# Altium schematic sheet Sensors.SchDoc
size A; SheetNumber: 3; SheetTotal: 6
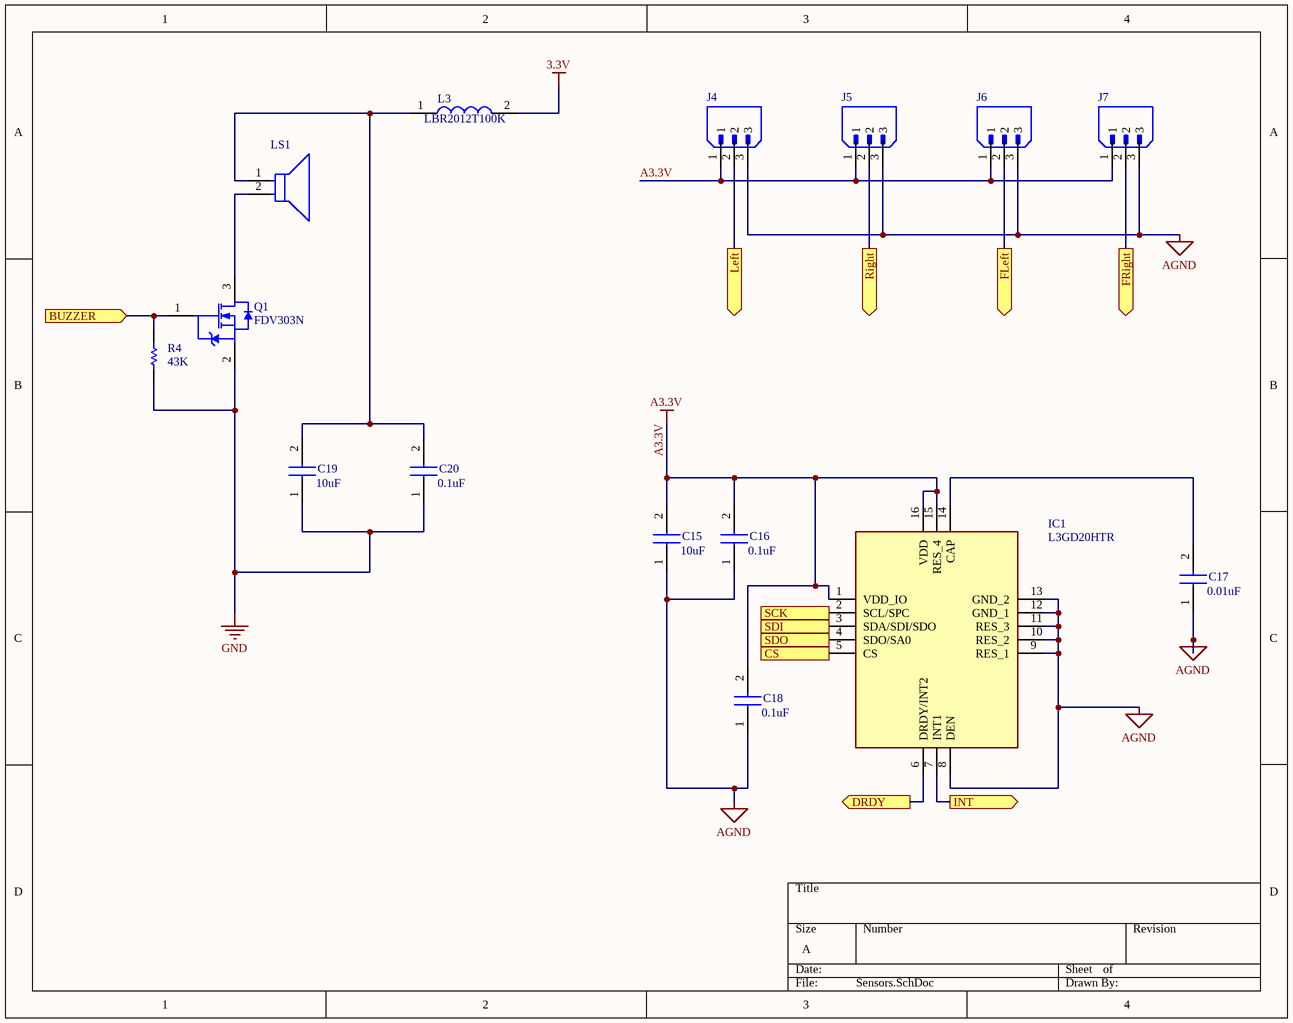
[diagram p0: Sensors.SchDoc]

## Parts
C15  value 10uF  [C0805]  (hidden comment: C0805C106K8PACTU)
C16  value 0.1uF  [C0805]  (hidden comment: C0805C104J8RACTU)
C17  value 0.01uF  [C0805]  (hidden comment: C0805C103K5RACTU)
C18  value 0.1uF  [C0805]  (hidden comment: C0805C104J8RACTU)
C19  value 10uF  [C0805]  (hidden comment: C0805C106K8PACTU)
C20  value 0.1uF  [C0805]  (hidden comment: C0805C104J8RACTU)
IC1  L3GD20HTR  [H3LIS100DLTR]
J4  B3B-XH-A_(LF)(SN)  [JST_B3B-XH-A (LF)(SN)]  (value not drawn)
J5  B3B-XH-A_(LF)(SN)  [JST_B3B-XH-A (LF)(SN)]  (value not drawn)
J6  B3B-XH-A_(LF)(SN)  [JST_B3B-XH-A (LF)(SN)]  (value not drawn)
J7  B3B-XH-A_(LF)(SN)  [JST_B3B-XH-A (LF)(SN)]  (value not drawn)
L3  LBR2012T100K  [INDC2012X145N]
LS1  AI-1223-TWT-3V-2-R  [FP-AI-1223-TWT-3V-2-R-MFG]  (value not drawn)
Q1  FDV303N  [FAIR-FDV303N-3_V]
R4  value 43K  [RESC1608X55X30ML20T20]  (hidden comment: ERA3AEB433V)

## Ports
BUZZER (in), CS (out), DRDY (out), FLeft (out), FRight (out), INT (out), Left (out), Right (out), SCK (out), SDI (out), SDO (out)

## Nets
3.3V: L3.2
A3.3V: C15.2 C16.2 C18.2 IC1.1(VDD_IO) IC1.15(RES_4) IC1.16(VDD) J4.1 J5.1 J6.1 J7.1
AGND: C15.1 C16.1 C17.1 C18.1 IC1.8(DEN) IC1.9(RES_1) IC1.10(RES_2) IC1.11(RES_3) IC1.12(GND_1) IC1.13(GND_2) J4.3 J5.3 J6.3 J7.3
GND: C19.1 C20.1 Q1.2(S) R4.1
BUZZER: Q1.1(G) R4.2 ; port BUZZER
CS: IC1.5(CS) ; port CS
DRDY: IC1.6(DRDY/INT2) ; port DRDY
FLeft: J6.2 ; port FLeft
FRight: J7.2 ; port FRight
INT: IC1.7(INT1) ; port INT
Left: J4.2 ; port Left
Right: J5.2 ; port Right
SCK: IC1.2(SCL/SPC) ; port SCK
SDI: IC1.3(SDA/SDI/SDO) ; port SDI
SDO: IC1.4(SDO/SA0) ; port SDO
NetC17_2: C17.2 IC1.14(CAP)
NetC19_2: C19.2 C20.2 L3.1 LS1.1(C)
NetLS1_2: LS1.2(A) Q1.3(D)

## Library data of the parts
C15 C19 = C0805C106K8PACTU: Capacitor; Manufacturer_Name: KEMET; Datasheet Link: https://content.kemet.com/datasheets/KEM_C1006_X5R_SMD.pdf; Height: 1.1mm; Manufacturer_Part_Number: C0805C106K8PACTU; Mouser Part Number: 80-C0805C106K8P; Mouser Price/Stock: https://www.mouser.co.uk/ProductDetail/KEMET/C0805C106K8PACTU?qs=Zpyg6gQUYs39C21BeavaKA%3D%3D; Arrow Part Number: C0805C106K8PACTU; Arrow Price/Stock: https://www.arrow.com/en/products/c0805c106k8pactu/kemet-corporation?region=nac
C16 C18 C20 = C0805C104J8RACTU: Capacitor; Manufacturer_Name: KEMET; Datasheet Link: https://content.kemet.com/datasheets/KEM_C1002_X7R_SMD.pdf; Height: 1.1mm; Manufacturer_Part_Number: C0805C104J8RACTU; Mouser Part Number: 80-C0805C104J8R; Mouser Price/Stock: https://www.mouser.co.uk/ProductDetail/KEMET/C0805C104J8RACTU?qs=zZwvocWqSRjRMIheUubV0A%3D%3D; Arrow Part Number: C0805C104J8RACTU; Arrow Price/Stock: https://www.arrow.com/en/products/c0805c104j8ractu/kemet-corporation?region=nac
C17 = C0805C103K5RACTU: Capacitor; Manufacturer_Name: KEMET; Datasheet Link: https://content.kemet.com/datasheets/KEM_C1002_X7R_SMD.pdf; Height: 1.1mm; Manufacturer_Part_Number: C0805C103K5RACTU; Mouser Part Number: 80-C0805C103K5R; Mouser Price/Stock: https://www.mouser.co.uk/ProductDetail/KEMET/C0805C103K5RACTU?qs=cw4evkOYbeJ17Si5k%2FymvA%3D%3D; Arrow Part Number: C0805C103K5RACTU; Arrow Price/Stock: https://www.arrow.com/en/products/c0805c103k5ractu/kemet-corporation?region=nac
IC1 = L3GD20HTR: Integrated Circuit; Manufacturer_Name: STMicroelectronics; Datasheet Link: http://www.st.com/content/ccc/resource/technical/document/datasheet/35/b1/e0/39/71/57/43/01/DM00060659.pdf/files/DM00060659.pdf/jcr:content/translations/en.DM00060659.pdf; Height: 1mm; Manufacturer_Part_Number: L3GD20HTR; Mouser Part Number: 511-L3GD20HTR; Mouser Price/Stock: https://www.mouser.co.uk/ProductDetail/STMicroelectronics/L3GD20HTR?qs=7v3IMFVTeKNoM%2F2Sb4QSlQ%3D%3D; Arrow Part Number: L3GD20HTR; Arrow Price/Stock: https://www.arrow.com/en/products/l3gd20htr/stmicroelectronics?region=nac
J4-J7 = B3B-XH-A_(LF)(SN): Connector Header Through Hole 3 position 0.098 (2.50mm); MF: JST Sales America Inc.; MP: B3B-XH-A (LF)(SN); SnapEDA_Link: https://www.snapeda.com/parts/B3B-XH-A%20(LF)(SN)/JST+Sales+America+Inc./view-part/?ref=snap; Package: None; Value: *; Check_prices: https://www.snapeda.com/parts/B3B-XH-A%20(LF)(SN)/JST+Sales+America+Inc./view-part/?ref=eda
L3 = LBR2012T100K: Inductor; Manufacturer_Name: TAIYO YUDEN; Datasheet Link: https://componentsearchengine.com/Datasheets/2/LBR2012T100K.pdf; Height: 1.45mm; Manufacturer_Part_Number: LBR2012T100K; Mouser Part Number: 963-LBR2012T100K; Mouser Price/Stock: https://www.mouser.co.uk/ProductDetail/TAIYO-YUDEN/LBR2012T100K?qs=PzICbMaShUet3AhlAozLXg%3D%3D; Arrow Part Number: LBR2012T100K; Arrow Price/Stock: https://www.arrow.com/en/products/lbr2012t100k/taiyo-yuden
LS1 = CMP-103888-000003-1: BUZZER MAGNETIC 3V 12MM TH; Min Supply Voltage (DC): 2V; Operating Supply Current: 30mA; Max Supply Voltage (DC): 4V; Input Type: DC; Frequency: 2.3kHz; Series: AI; Nominal Supply Voltage (DC): 3V; Packaging: Tray; Max Operating Temperature: 70°C; Height: 7.5mm; Termination: PC Pins; Max Supply Current: 30mA; Mount: Through Hole; Diameter: 12mm; Voltage Rating: 3V; Sensing Method: Magnetic; Min Operating Temperature: -20°C; Contact Plating: Tin
Q1 = CMP-2000-05111-1: N-Channel MOSFET Transistor, 8 V VGSS, 25 V VDSS, 0.68 A, -55 to 150 degC, 3-Pin SOT23, RoHS, Tape and Reel; Manufacturer: Fairchild; Typical Turn-On Delay Time: 3ns; Channel Mode: Enhancement; RDS-on: 450@4.5VmOhm; Maximum Continuous Drain Current: 0.68A; Maximum Drain Source Voltage: 25V; Rad Hard: No; Typical Fall Time: 13ns; Channel Type: N; Typical Turn-Off Delay Time: 17ns; Maximum Gate Source Voltage: 8V; Typical Rise Time: 8.5ns; Mounting: SurfaceMount; Packaging: Tape&Reel; Manufacturer URL: https://www.fairchildsemi.com/; Datasheet URL: https://datasheet.ciiva.com/22681/1845307-22681736.pdf; Package: 3SOT-23; Category: MOSFET; Operating Temperature: -55to150degC; Datasheet Version: Rev. D2, 07/2014
R4 = CMP-2000-00064-1: Manufacturer: Panasonic; Part Number: ERA3AEB433V